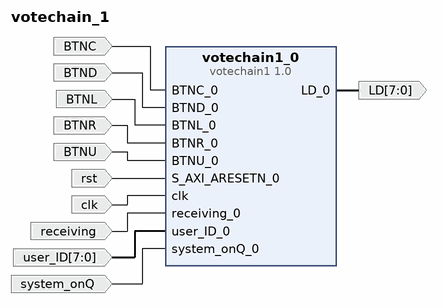
[diagram p0: block diagram of the top level]
# Vivado block design votechain_1, xc7z020clg484-1, Vivado 2018.2
create_bd_design votechain_1

create_bd_port -dir I BTNC
create_bd_port -dir I BTND
create_bd_port -dir I BTNL
create_bd_port -dir I BTNR
create_bd_port -dir I BTNU
create_bd_port -dir I -type rst rst
set_property -dict {CONFIG.POLARITY ACTIVE_LOW} [get_bd_ports rst]
create_bd_port -dir I -type clk clk
create_bd_port -dir I receiving
create_bd_port -dir I -from 7 -to 0 user_ID
create_bd_port -dir I system_onQ
create_bd_port -dir O -from 7 -to 0 LD

create_bd_cell -type ip -vlnv xilinx.com:user:votechain1:1.0 votechain1_0

# ---- connections ----

connect_bd_net [get_bd_ports BTNC] [get_bd_pins votechain1_0/BTNC_0]
connect_bd_net [get_bd_ports BTND] [get_bd_pins votechain1_0/BTND_0]
connect_bd_net [get_bd_ports BTNL] [get_bd_pins votechain1_0/BTNL_0]
connect_bd_net [get_bd_ports BTNR] [get_bd_pins votechain1_0/BTNR_0]
connect_bd_net [get_bd_ports BTNU] [get_bd_pins votechain1_0/BTNU_0]
connect_bd_net [get_bd_ports rst] [get_bd_pins votechain1_0/S_AXI_ARESETN_0]
connect_bd_net [get_bd_ports clk] [get_bd_pins votechain1_0/clk]
connect_bd_net [get_bd_ports receiving] [get_bd_pins votechain1_0/receiving_0]
connect_bd_net [get_bd_ports user_ID] [get_bd_pins votechain1_0/user_ID_0]
connect_bd_net [get_bd_ports system_onQ] [get_bd_pins votechain1_0/system_onQ_0]
connect_bd_net [get_bd_pins votechain1_0/LD_0] [get_bd_ports LD]

validate_bd_design
save_bd_design
